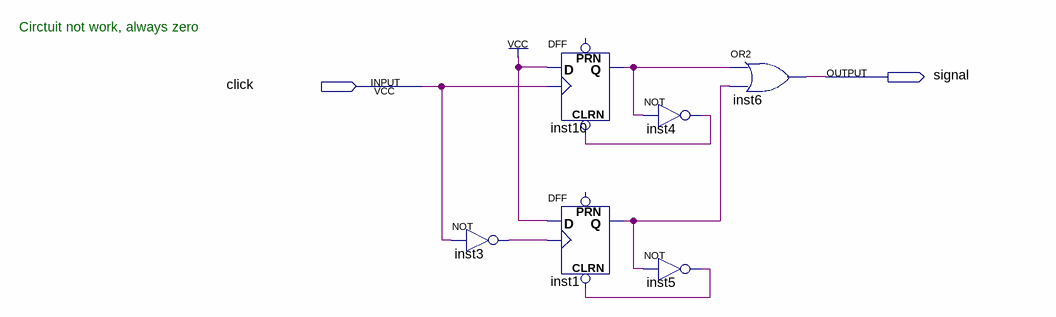
[diagram p0: schematic sheet]
// Quartus schematic click_signal.bdf as structural Verilog: 6 symbols, 2 pins
module click_signal (
  input  click,
  output signal
);

  wire inst1_q, inst3_out, inst4_out, inst5_out, inst10_q;

  not inst3 (inst3_out, click);
  DFF inst10 (.CLRN(inst4_out), .CLK(click), .D(1'b1), .Q(inst10_q));  // open: PRN
  DFF inst1 (.CLRN(inst5_out), .CLK(inst3_out), .D(1'b1), .Q(inst1_q));  // open: PRN
  not inst4 (inst4_out, inst10_q);
  not inst5 (inst5_out, inst1_q);
  or inst6 (signal, inst10_q, inst1_q);

  // Notes on the sheet:
  //   Circtuit not work, always zero
endmodule
